# Altium schematic sheet SH1 - CAN.SchDoc: CAN Transceivers
size B; CheckedBy: Wolfgang Windholtz; Engineer: Sahil Kale; Revision: 1.0; SheetNumber: 1; SheetTotal: 7
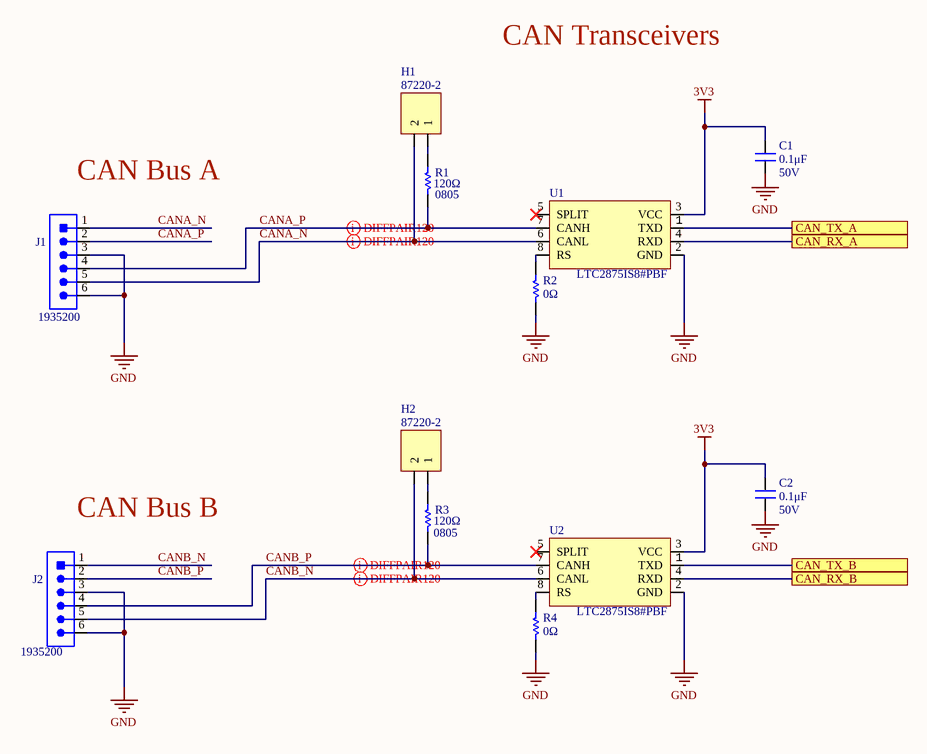
[diagram p0: SH1 - CAN.SchDoc]

## Parts
C1  value 0.1μF  Voltage Rating: 50V  [CAP2012]  (hidden comment: CAP_0.1uF_50V_0805)
C2  value 0.1μF  Voltage Rating: 50V  [CAP2012]  (hidden comment: CAP_0.1uF_50V_0805)
H1  Manufacturer Part Number 1: 87220-2  [HDR1X2]  (hidden comment: JUMPER)
H2  Manufacturer Part Number 1: 87220-2  [HDR1X2]  (hidden comment: JUMPER)
J1  CON_6POS_SCREW_TERM  [1935200]  (value not drawn)
J2  CON_6POS_SCREW_TERM  [1935200]  (value not drawn)
R1  value 120Ω  Package/Footprint: 0805  [RESC0805]  (hidden comment: RES_120Ω_0805_1%)
R2  value 0Ω  [RESC0805]  (hidden comment: RES_0Ω_0805)
R3  value 120Ω  Package/Footprint: 0805  [RESC0805]  (hidden comment: RES_120Ω_0805_1%)
R4  value 0Ω  [RESC0805]  (hidden comment: RES_0Ω_0805)
U1  Manufacturer Part Number 1: LTC2875IS8#PBF  [LT-S8_N]  (hidden comment: IC_CAN_TRANSCEIVER)
U2  Manufacturer Part Number 1: LTC2875IS8#PBF  [LT-S8_N]  (hidden comment: IC_CAN_TRANSCEIVER)

## Ports
CAN_RX_A, CAN_RX_B, CAN_TX_A, CAN_TX_B

## Nets
3V3: C1.1 C2.1 U1.3(VCC) U2.3(VCC)
GND: C1.2 C2.2 J1.3 J1.6 J2.3 J2.6 R2.1 R4.1 U1.2(GND) U2.2(GND)
CAN_RX_A: U1.4(RXD) ; port CAN_RX_A
CAN_RX_B: U2.4(RXD) ; port CAN_RX_B
CAN_TX_A: U1.1(TXD) ; port CAN_TX_A
CAN_TX_B: U2.1(TXD) ; port CAN_TX_B
CANA_N: H1.2 J1.1 J1.5 U1.6(CANL)
CANA_P: J1.2 J1.4 R1.1 U1.7(CANH)
CANB_N: H2.2 J2.1 J2.5 U2.6(CANL)
CANB_P: J2.2 J2.4 R3.1 U2.7(CANH)
NetH1_1: H1.1 R1.2
NetH2_1: H2.1 R3.2
NetR2_2: R2.2 U1.8(RS)
NetR4_2: R4.2 U2.8(RS)

Not connected (* = marked no-connect by the designer): U1 5(SPLIT)*; U2 5(SPLIT)*

## Layout directives
differential pair: CANA_N, CANA_P, CANB_N, CANB_P

## Notes on the sheet
- CAN Transceivers
- (near J1) CAN Bus A
- (near J2) CAN Bus B
- Title:
- Project:
- Date:
- Rev:
- Checker:
- Engineer:
- Sheet:
- of

## Library data of the parts
C1 C2 = CAP_0.1uF_50V_0805: CAP CER 0.1UF 50V X7R 0805; Manufacturer Part Number 1: GCM21BR71H104KA37K; Manufacturer 1: Murata Electronics; Package/Footprint: 0805; Supplier Part Number 1: 490-8049-1-ND; Supplier 1: Digi-Key; Dielectric: X7R; Mounting Type: SMD; LCSC Part #: C49678
H1 H2 = JUMPER: HEADER 2X1; Manufacturer 1: TE Connectivity; Package/Footprint: TH; Supplier 1: Digi-Key; Supplier Part Number 1: A26542-ND; Mounting Type: TH
J1 J2 = CON_6POS_SCREW_TERM: TERM BLK 6POS SIDE ENTRY 5MM; Manufacturer 1: Phoenix Contact; Package/Footprint: TH; Wire Gauge: 12-26AWG; Screw Thread: M2.6; Supplier 1: Digi-Key; Supplier Part Number 1: 277-1581-ND; Mounting Type: TH; Pitch: 5mm; Manufacturer Part Number 1: 1935200
R1 R3 = RES_120Ω_0805_1%: RES 120 OHM 1% 1/8W 0805; Manufacturer 1: Vishay; Manufacturer Part Number 1: CRCW0805120RFKEA; Supplier Part Number 1: 541-120CCT-ND; Supplier 1: Digi-Key; Mounting Type: SMD; LCSC Part #: C17437
R2 R4 = RES_0Ω_0805: RES 0 OHM JUMPER 1/8W 0805; Manufacturer 1: Panasonic Electronic Components; Manufacturer Part Number 1: ERJ-6GEY0R00V; Package/Footprint: 0805; Supplier Part Number 1: P0.0ACT-ND; Supplier 1: Digi-Key; Mounting Type: SMD; LCSC Part #: C17477
U1 U2 = IC_CAN_TRANSCEIVER: IC TXRX CAN 4MBPS 8SO; Manufacturer 1: Linear Technologies; Package/Footprint: 8-SOIC; Supplier Part Number 1: LTC2875IS8#PBF-ND; Supplier 1: Digi-Key; Mounting Type: SMD; LCSC Part #: C117076